# Altium schematic sheet Camera.SchDoc
size B; DocumentNumber: 4; SheetNumber: 4; SheetTotal: 9; ENG_APP_DATE: --/--/--; DSN_APP_DATE: --/--/--; CHK_APP_DATE: --/--/--
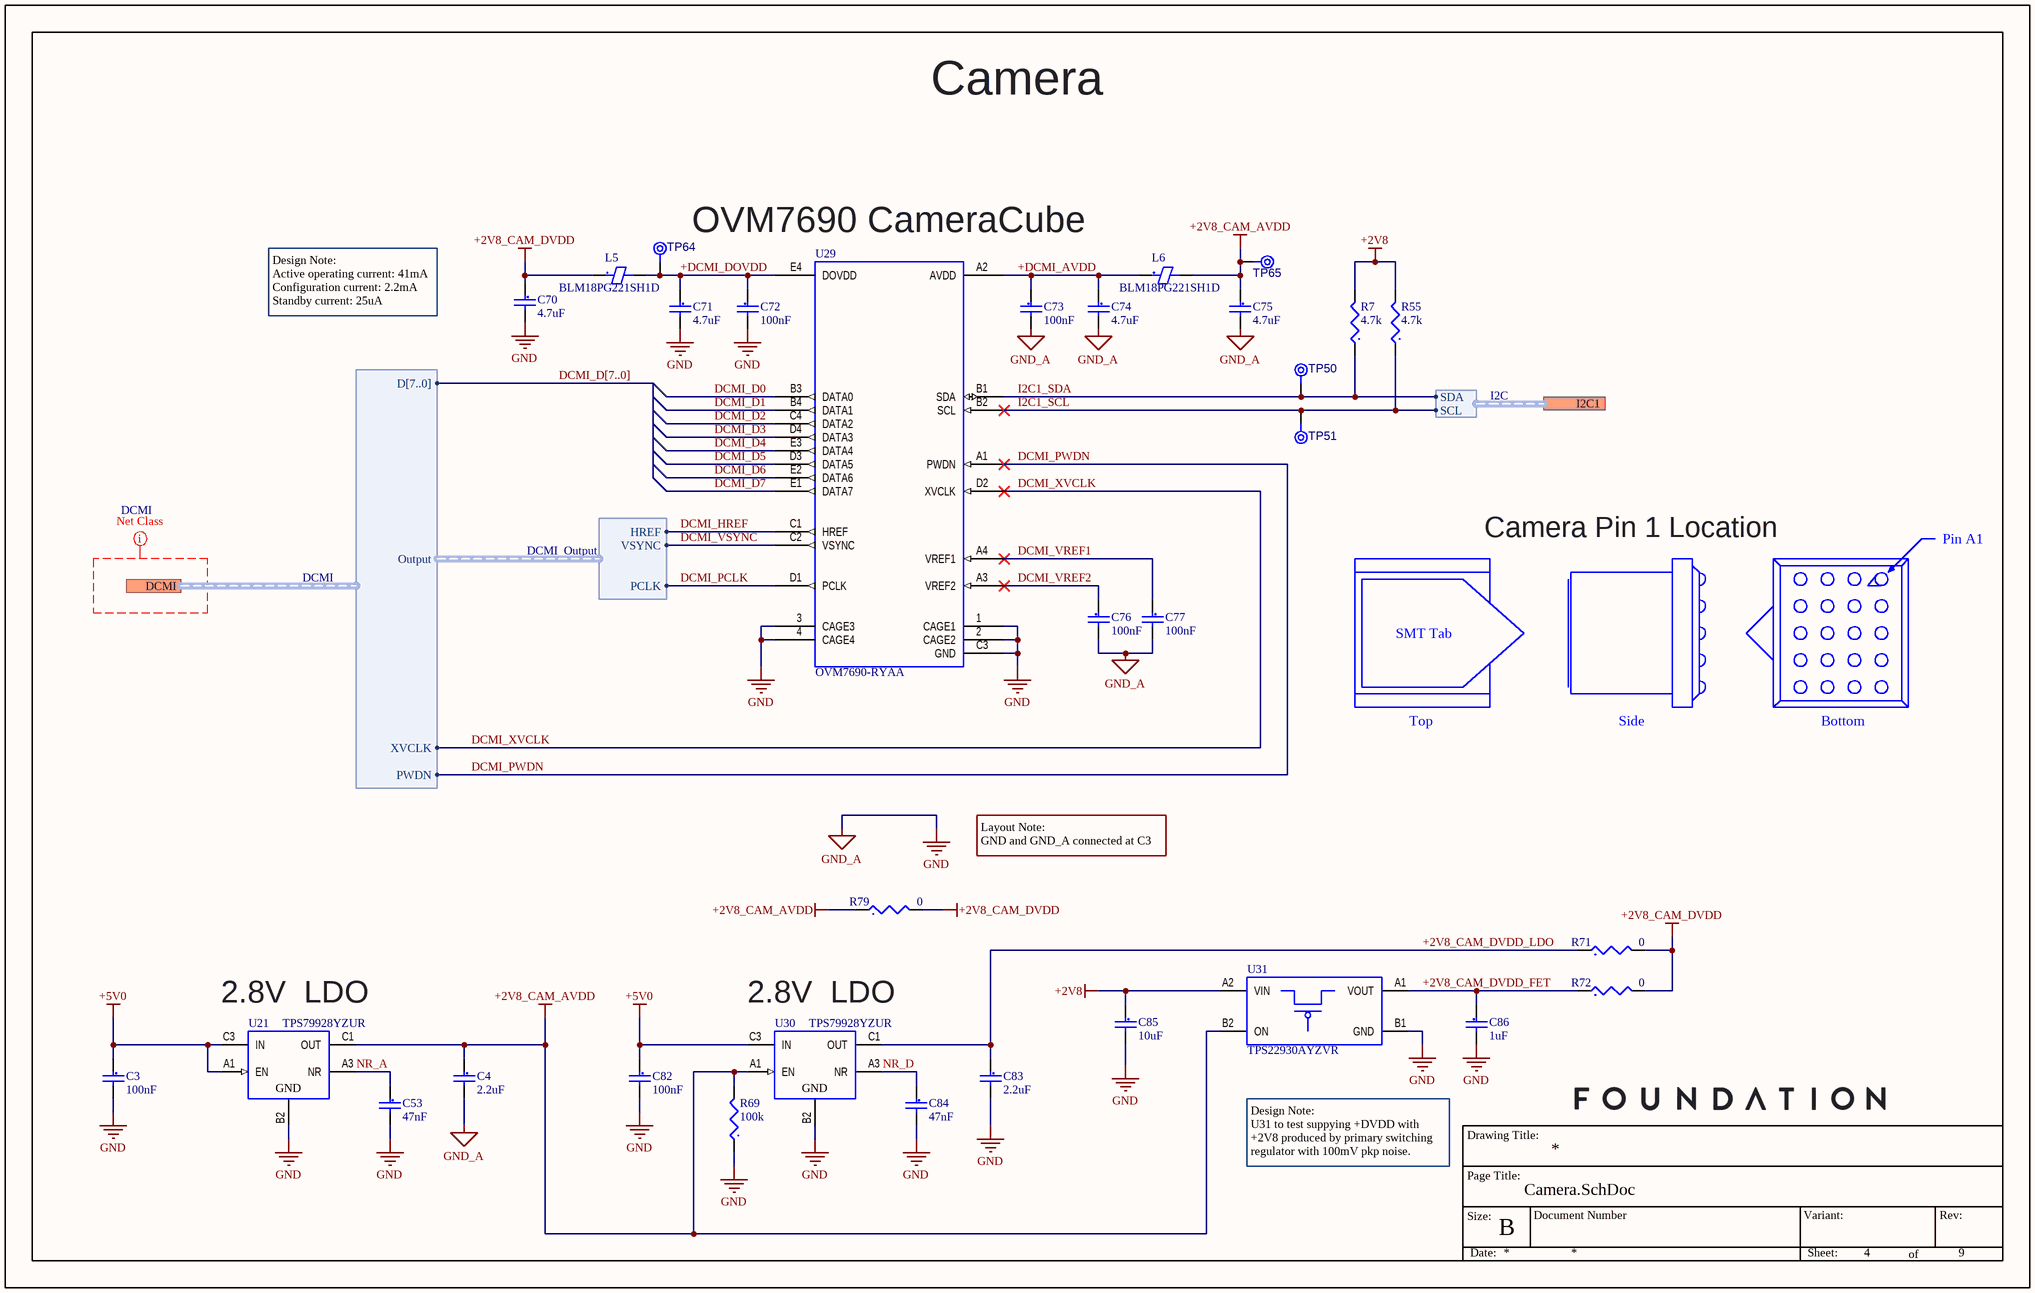
[diagram p0: Camera.SchDoc]

## Parts
C3  Capacitance: 100nF  [CAPC0402(1005)55_L]  (hidden comment: CAP CER 0.1uF 16V 10% X7R 0402)
C4  Capacitance: 2.2uF  [CAPC0402(1005)55_L]  (hidden comment: CAP CER 2.2uF 6.3V 10% X5R 0402)
C53  Capacitance: 47nF  [CAPC0402(1005)55_L]  (hidden comment: CAP CER 0.047uF 10V 10% X7R 0402)
C70  Capacitance: 4.7uF  [CAPC0402(1005)55_L]  (hidden comment: CAP CER 4.7UF 10V 20% X5R 0402)
C71  Capacitance: 4.7uF  [CAPC0402(1005)55_L]  (hidden comment: CAP CER 4.7UF 10V 20% X5R 0402)
C72  Capacitance: 100nF  [CAPC0402(1005)55_L]  (hidden comment: CAP CER 0.1uF 16V 10% X7R 0402)
C73  Capacitance: 100nF  [CAPC0402(1005)55_L]  (hidden comment: CAP CER 0.1uF 16V 10% X7R 0402)
C74  Capacitance: 4.7uF  [CAPC0402(1005)55_L]  (hidden comment: CAP CER 4.7UF 10V 20% X5R 0402)
C75  Capacitance: 4.7uF  [CAPC0402(1005)55_L]  (hidden comment: CAP CER 4.7UF 10V 20% X5R 0402)
C76  Capacitance: 100nF  [CAPC0402(1005)55_L]  (hidden comment: CAP CER 0.1uF 16V 10% X7R 0402)
C77  Capacitance: 100nF  [CAPC0402(1005)55_L]  (hidden comment: CAP CER 0.1uF 16V 10% X7R 0402)
C82  Capacitance: 100nF  [CAPC0402(1005)55_L]  (hidden comment: CAP CER 0.1uF 16V 10% X7R 0402)
C83  Capacitance: 2.2uF  [CAPC0402(1005)55_L]  (hidden comment: CAP CER 2.2uF 6.3V 10% X5R 0402)
C84  Capacitance: 47nF  [CAPC0402(1005)55_L]  (hidden comment: CAP CER 0.047uF 10V 10% X7R 0402)
C85  Capacitance: 10uF  [CAPC0402(1005)55_L]  (hidden comment: CAP CER 10uF 10V 20% X5R 0402)
C86  Capacitance: 1uF  [CAPC0402(1005)55_L]  (hidden comment: CAP CER 1uF 25V 10% X5R 0402)
L5  BLM18PG221SH1D  [FBC0603(1608)90_L]
L6  BLM18PG221SH1D  [FBC0603(1608)90_L]
R7  Resistance: 4.7k  [RESC0402(1005)_L]  (hidden comment: RES 4.7K 1/16W 1% 0402)
R55  Resistance: 4.7k  [RESC0402(1005)_L]  (hidden comment: RES 4.7K 1/16W 1% 0402)
R69  Resistance: 100k  [RESC0402(1005)_L]  (hidden comment: RES 100K 1/16W 1% 0402)
R71  Resistance: 0  [RESC0603(1608)_L]  (hidden comment: RES 0 OHM JUMPER 1/10W 0603)
R72  Resistance: 0  [RESC0603(1608)_L]  (hidden comment: RES 0 OHM JUMPER 1/10W 0603)
R79  Resistance: 0  [RESC0603(1608)_L]  (hidden comment: RES 0 OHM JUMPER 1/10W 0603)
TP50  TPAD8R  [TP08R]  (value not drawn)  (no BOM)
TP51  TPAD8R  [TP08R]  (value not drawn)  (no BOM)
TP64  TPAD8R  [TP08R]  (value not drawn)  (no BOM)
TP65  TPAD8R  [TP08R]  (value not drawn)  (no BOM)
U21  TPS79928YZUR  [TI - DSBGA-YZU-5_V]
U29  OVM7690-RYAA  [OMNI - CCBGA-CG-20]
U30  TPS79928YZUR  [TI - DSBGA-YZU-5_V]
U31  TPS22930AYZVR  [TI - DSBGA-YZV-4_V]

## Ports
DCMI (harness DCMI), I2C1 (harness I2C)

## Harnesses
I2C: SCL, SDA
DCMI: Output, D[7..0], XVCLK, PWDN
DCMI_Output: HREF, VSYNC, PCLK

## Nets
+2V8: C85.1 R7.2 R55.2 U31.A2(VIN)
+2V8_CAM_AVDD: C4.1 C75.1 L6.2 R69.2 R79.1 TP65.1(TP) U21.C1(OUT) U30.A1(EN) U31.B2(ON)
+2V8_CAM_DVDD: C70.1 L5.1 R71.2 R72.2 R79.2
+5V0: C3.1 C82.1 U21.A1(EN) U21.C3(IN) U30.C3(IN)
GND: C3.2 C4.2 C53.2 C70.2 C71.2 C72.2 C73.2 C74.2 C75.2 C76.2 C77.2 C82.2 C83.2 C84.2 C85.2 C86.2 R69.1 U21.B2(GND) U29.1(CAGE1) U29.2(CAGE2) U29.3(CAGE3) U29.4(CAGE4) U29.C3(GND) U30.B2(GND) U31.B1(GND)  [also labelled GND_A]
+2V8_CAM_DVDD_FET: C86.1 R72.1 U31.A1(VOUT)
+2V8_CAM_DVDD_LDO: C83.1 R71.1 U30.C1(OUT)
+DCMI_AVDD: C73.1 C74.1 L6.1 U29.A2(AVDD)
+DCMI_DOVDD: C71.1 C72.1 L5.2 TP64.1(TP) U29.E4(DOVDD)
DCMI_D0: U29.B3(DATA0)
DCMI_D1: U29.B4(DATA1)
DCMI_D2: U29.C4(DATA2)
DCMI_D3: U29.D4(DATA3)
DCMI_D4: U29.E3(DATA4)
DCMI_D5: U29.D3(DATA5)
DCMI_D6: U29.E2(DATA6)
DCMI_D7: U29.E1(DATA7)
DCMI_HREF: U29.C1(HREF) ; harness DCMI_Output.HREF
DCMI_PCLK: U29.D1(PCLK) ; harness DCMI_Output.PCLK
DCMI_PWDN: U29.A1(PWDN) ; port DCMI.PWDN
DCMI_VREF1: C77.1 U29.A4(VREF1)
DCMI_VREF2: C76.1 U29.A3(VREF2)
DCMI_VSYNC: U29.C2(VSYNC) ; harness DCMI_Output.VSYNC
DCMI_XVCLK: U29.D2(XVCLK) ; port DCMI.XVCLK
I2C1_SCL: R55.1 TP51.1(TP) U29.B2(SCL) ; port I2C1.SCL
I2C1_SDA: R7.1 TP50.1(TP) U29.B1(SDA) ; port I2C1.SDA
NR_A: C53.1 U21.A3(NR)
NR_D: C84.1 U30.A3(NR)

## Buses and harness runs
bus DCMI_D[7..0]

## Layout directives
net class DCMI: (no net found under the mark)

## Notes on the sheet
- Camera
- (near U29) OVM7690 CameraCube
- Design Note:
  Active operating current: 41mA
  Configuration current: 2.2mA
  Standby current: 25uA
- Camera Pin 1 Location
- Pin A1
- SMT Tab
- Top
- Side
- Bottom
- Layout Note:
  GND and GND_A connected at C3
- (near U21) 2.8V  LDO
- (near U30) 2.8V  LDO
- Design Note:
  U31 to test suppying +DVDD with +2V8 produced by primary switching regulator with 100mV pkp noise.
- Drawing Title:
- Page Title:
- Size:
- B
- Document Number
- Variant:
- Rev:
- Date:
- Sheet:
- of

## Library data of the parts
C3 C72 C73 C76 C77 C82 = CMP-CAP-00002-2: 0.1µF ±10% 16V Ceramic Capacitor X7R 0402 (1005 Metric); Insulation Resistance: 10GR; Material: Ceramic; Tolerance: 10%; REACH SVHC: No SVHC; Radiation Hardening: No; Case Code (Metric): 1005; Height: 0.5mm; Depth: 0.5mm; Min Operating Temperature: -55°C; Max Operating Temperature: 125°C; Lead Free: Lead Free; Thickness: 0.022inch; Length: 1mm; Voltage Rating (DC): 16V; Dielectric Material: Ceramic; Packaging: Tape and Reel; Case/Package: 0402; Width: 0.5mm; Termination: SMD/SMT; Voltage Rating: 16V; Mount: Surface Mount; Case Code (Imperial): 0402; Package Quantity: 1; Dielectric: X7R; Number of Pins: 2; Voltage: 16V
C4 C83 = CMP-CAP-00042-1: 2.2µF ±10% 6.3V Ceramic Capacitor X5R 0402 (1005 Metric); Lead Free: Lead Free; Tolerance: 10%; Width: 0.02inch; Number of Pins: 2; Contact Plating: Tin,Matte; Max Operating Temperature: 85°C; Termination: SMD/SMT; Voltage Rating: 6.3V; Thickness: 0.022inch; Case Code (Imperial): 0402; Case Code (Metric): 1005; Radiation Hardening: No; Package Quantity: 1; Mount: Surface Mount; Length: 1mm; Case/Package: 0402; REACH SVHC: No SVHC; Packaging: Tape and Reel; Min Operating Temperature: -55°C; Dielectric: X5R; Depth: 0.5mm; Voltage Rating (DC): 6.3V
C53 C84 = CMP-CAP-00056-1: 0.047µF ±10% 10V Ceramic Capacitor X7R 0402 (1005 Metric); Number of Terminals/Pins: 2; Multilayer: Yes; Height: 0.5mm; Package Shape: Rectangular; Positive Tolerance: 10%; Max Operating Temperature: 125°C; Termination: Wraparound; Capacitor Type: Ceramic; Width: 0.5mm; Negative Tolerance: 10%; Rated DC Voltage (URdc): 10V; Length: 1mm; Mount: Surface Mount; Size Code: 0402; JESD-609 Code: e3; Temperature Characteristics Code: X7R; Min Operating Temperature: -55°C; Terminal Finish: Nickel; Package Style: SMTMeter; Packaging: Tape and Reel; Dielectric Material: Ceramic
C70 C71 C74 C75 = CMP-CAP-00038-1: 4.7µF ±20% 10V Ceramic Capacitor X5R 0402 (1005 Metric); Length: 1mm; Termination: SMD/SMT; Max Operating Temperature: 85°C; Case Code (Imperial): 0402; Height: 0.5mm; Voltage Rating: 10V; Composition: Ceramic; Dielectric: X5R; Voltage Rating (DC): 10V; REACH SVHC: No SVHC; Case Code (Metric): 1005; Tolerance: 20%; Case/Package: 0402; Min Operating Temperature: -55°C; Width: 0.02inch; Mount: Surface Mount; Packaging: Tape and Reel; Package Quantity: 1; Thickness: 500um; Radiation Hardening: No; Voltage: 10V; Depth: 0.5mm; Weight: 2.3E-05oz; Dielectric Material: Ceramic; Lead Free: Lead Free
C85 = CMP-CAP-00007-2: 10µF ±20% 10V Ceramic Capacitor X5R 0402 (1005 Metric); Radiation Hardening: No; Mount: Surface Mount; Voltage Rating: 10V; Contact Plating: Tin; Length: 1mm; Lead Free: Lead Free; Dielectric: X5R; Packaging: Tape and Reel; Depth: 0.5mm; Case Code (Imperial): 0402; Termination: Wraparound; Min Operating Temperature: -55°C; Package Quantity: 1; Case Code (Metric): 1005; Width: 0.02inch; Thickness: 0.028inch; Tolerance: 20%; Case/Package: 0402; Max Operating Temperature: 85°C
C86 = CMP-CAP-00053-2: 1uF ±10% 25V Ceramic Capacitor X5R 0402 (1005 Metric); Number of Terminals/Pins: 2; Multilayer: Yes; Mount: Surface Mount; Length: 1mm; Packaging: Tape and Reel; Termination: Wraparound; Min Operating Temperature: -55°C; Width: 0.5mm; Capacitor Type: Ceramic; Max Operating Temperature: 85°C; Height: 0.6mm; Dielectric Material: Ceramic; Negative Tolerance: 10%; Package Style: SMTMeter; Package Shape: Rectangular; Size Code: 0402; Rated DC Voltage (URdc): 25V; Terminal Finish: Nickel; Positive Tolerance: 10%; JESD-609 Code: e3; Temperature Characteristics Code: X5R
L5 L6 = CMP-FLT-0001-1: FERRITE BEAD 220 OHM 0603 1LN; Impedance: 220R; Number of Circuits: 1; Tolerance: 25%; Max DC Current: 1.4A; Test Frequency: 100MHz; DC Resistance (DCR): 100mR; Packaging: Tape and Reel; Length: 0.063inch; Case Code (Metric): 1608; Termination: SMD/SMT; Height: 0.037inch; Ratings: AEC-Q200; Max Operating Temperature: 125°C; Depth: 0.95mm; Lead Free: Lead Free; Current Rating: 1.4A; Mount: Surface Mount; ComponentLink1Description: Datasheet; Case/Package: 0603; Number of Lines: 1; Max Current Rating: 1.4A; Case Code (Imperial): 0603; Min Operating Temperature: -55°C; Width: 0.8mm; REACH SVHC: No SVHC; Core Material: Ferrite; ComponentLink1URL: https://www.murata.com/en-us/products/productdata/8796737273886/QNFA9101.pdf; Package Quantity: 4000
R7 R55 = CMP-RES-00002-3: 4.7 kOhms ±1% 0.063W, 1/16W Chip Resistor 0402 (1005 Metric) Automotive AEC-Q200 Thick Film; Max Power Dissipation: 63mW; Voltage Rating (DC): 50V; Temperature Coefficient: 100ppm/°C; Weight: 2.3E-05oz; Package Quantity: 10; Military Standard: Not; Contact Plating: Tin; Termination: SMD/SMT; Max Operating Temperature: 155°C; Case Code (Metric): 1005; Case Code (Imperial): 0402; Features: Automotive AEC-Q200; Power Rating: 63mW; REACH SVHC: Unknown; Min Operating Temperature: -55°C; Tolerance: 1%; Mount: Surface Mount; Width: 0.5mm; Depth: 0.5mm; Radiation Hardening: No; Length: 1mm; Number of Terminations: 2; Case/Package: 0402; Voltage Rating: 50V; Height: 0.35mm; Packaging: Tape and Reel; Lead Free: Lead Free; Composition: Thick Film
R69 = CMP-RES-00003-3: 100 kOhms ±1% 0.063W, 1/16W Chip Resistor 0402 (1005 Metric) Automotive AEC-Q200 Thick Film; Temperature Coefficient: 100ppm/°C; Voltage Rating (DC): 50V; Max Power Dissipation: 63mW; Number of Terminations: 2; Case/Package: 0402; Length: 1mm; Military Standard: Not; Mount: Surface Mount; Termination: SMD/SMT; Radiation Hardening: No; Package Quantity: 10000; Case Code (Metric): 1005; Case Code (Imperial): 0402; REACH SVHC: Unknown; Depth: 0.5mm; Features: Automotive AEC-Q200; Voltage Rating: 50V; Min Operating Temperature: -55°C; Lead Free: Lead Free; Power Rating: 63mW; Number of Pins: 2; Max Operating Temperature: 155°C; Contact Plating: Tin; Weight: 2.3E-05oz; Packaging: Tape and Reel; Tolerance: 1%; Height: 0.35mm; Composition: Thick Film; Width: 0.02inch
R71 R72 R79 = CMP-RES-00053-1: 0 Ohms Jumper 0.1W, 1/10W Chip Resistor 0603 (1608 Metric); Power Rating: 100mW; Temperature Coefficient: 200ppm/°C; Tolerance: 1%; Voltage Rating: 50V; Depth: 0.8mm; Military Standard: Not; Width: 0.8mm; Number of Pins: 2; Max Operating Temperature: 155°C; Composition: Thick Film; Min Operating Temperature: -55°C; Case Code (Imperial): 0603; Case Code (Metric): 1608; Packaging: Tape and Reel; Height: 0.45mm; Radiation Hardening: No; Lead Free: Lead Free; Case/Package: 0603; Package Quantity: 5000; Voltage Rating (DC): 50V; Contact Plating: Tin,Matte; Termination: SMD/SMT; Length: 1.6mm; REACH SVHC: No SVHC
TP50 TP51 TP64 TP65 = CMP-MECH-00011-2: 0.8mm round; Pins: 1
U21 U30 = CMP-PMIC-00036-2: Linear Voltage Regulator IC  1 Output  200mA 5-DSBGA (1x1.37); Regulator Type: FIXED POSITIVE SINGLE OUTPUT LDO REGULATOR; Number of Outputs: 1; Input Voltage Absolute-Max: 7V; Voltage Tolerance-Max: 2%; Max Input Voltage: 6.5V; Dropout Voltage1-Max: 175mV; Dropout Voltage1-Nom: 100mV; Qualification Status: Not Qualified; Output Voltage1-Max: 2.856V; Number of Terminals/Pins: 5; Adjustability: FIXED; Output Voltage1-Min: 2.744V; Output Voltage1-Nom: 2.8V; Min Input Voltage: 2.975V; Package Code: VFBGA; Operating Temperature, TJ-Min: -40°C; Output Current1-Max: 200mA; Technology: BICMOS; Terminal Pitch: 0.5mm; Operating Temperature, TJ-Max: 125°C; Packaging: Tape and Reel; Surface Mount: Yes; Width: 1.195mm; Package Style: GRID ARRAY, VERY THIN PROFILE, FINE PITCHMeter; Terminal Position: BOTTOM; Terminal Form: Ball; Height - Seated (Max): 0.625mm; Terminal Finish: Copper; Package Shape: Rectangular; Moisture Sensitivity Level: 1; Number of Functions: 1; Length: 1.53mm; JESD-609 Code: e1; Peak Reflow Temperature (Cel): 260°C; ComponentLink1URL: https://www.ti.com/lit/ds/sbvs056k/sbvs056k.pdf; ComponentLink1Description: Datasheet
U29 = CMP-SEN-0001-12: SENSOR CAMERA CMOS 20CAMERACUBE; Min Operating Temperature: -30°C; Number of Pins: 20; Packaging: Tape and Reel; Max Operating Temperature: 70°C; Package Quantity: 2500
U31 = CMP-PMIC-00044-1: IC PWR SWITCH P-CHAN 1:1 4DSBGA; Analog IC - Other Type: SPST; Moisture Sensitivity Level: 1; REACH SVHC: Yes; JESD-609 Code: e1; RoHS Compliant: Yes; ComponentLink1URL: https://www.ti.com/lit/ds/symlink/tps22930a.pdf?HQS=dis-dk-null-digikeymode-dsf-pf-null-wwe&ts=1618591669570; Terminal Finish: Copper; ComponentLink1Description: Datasheet; Peak Reflow Temperature (Cel): 260°C